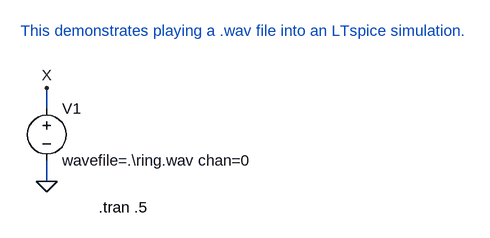
[diagram p0: schematic WaveIn.asc]
WaveIn.asc, the LTspice schematic file:
Version 4
SHEET 1 2096 1120
WIRE 1184 896 1184 864
WIRE 1184 1008 1184 976
FLAG 1184 1008 0
FLAG 1184 864 X
SYMBOL VOLTAGE 1184 880 R0
SYMATTR InstName V1
SYMATTR Value wavefile=.\ring.wav chan=0
TEXT 1264 1048 Left 0 !.tran .5
TEXT 1144 776 Left 0 ;This demonstrates playing a .wav file into an LTspice simulation.

The netlist it stands for:
* WaveIn.asc
V1 X 0 wavefile=.\ring.wav chan=0
.tran .5
* This demonstrates playing a .wav file into an LTspice simulation.
.backanno
.end